# EAGLE schematic FINAL COMMON BOARD (EAGLE 9.5.2)
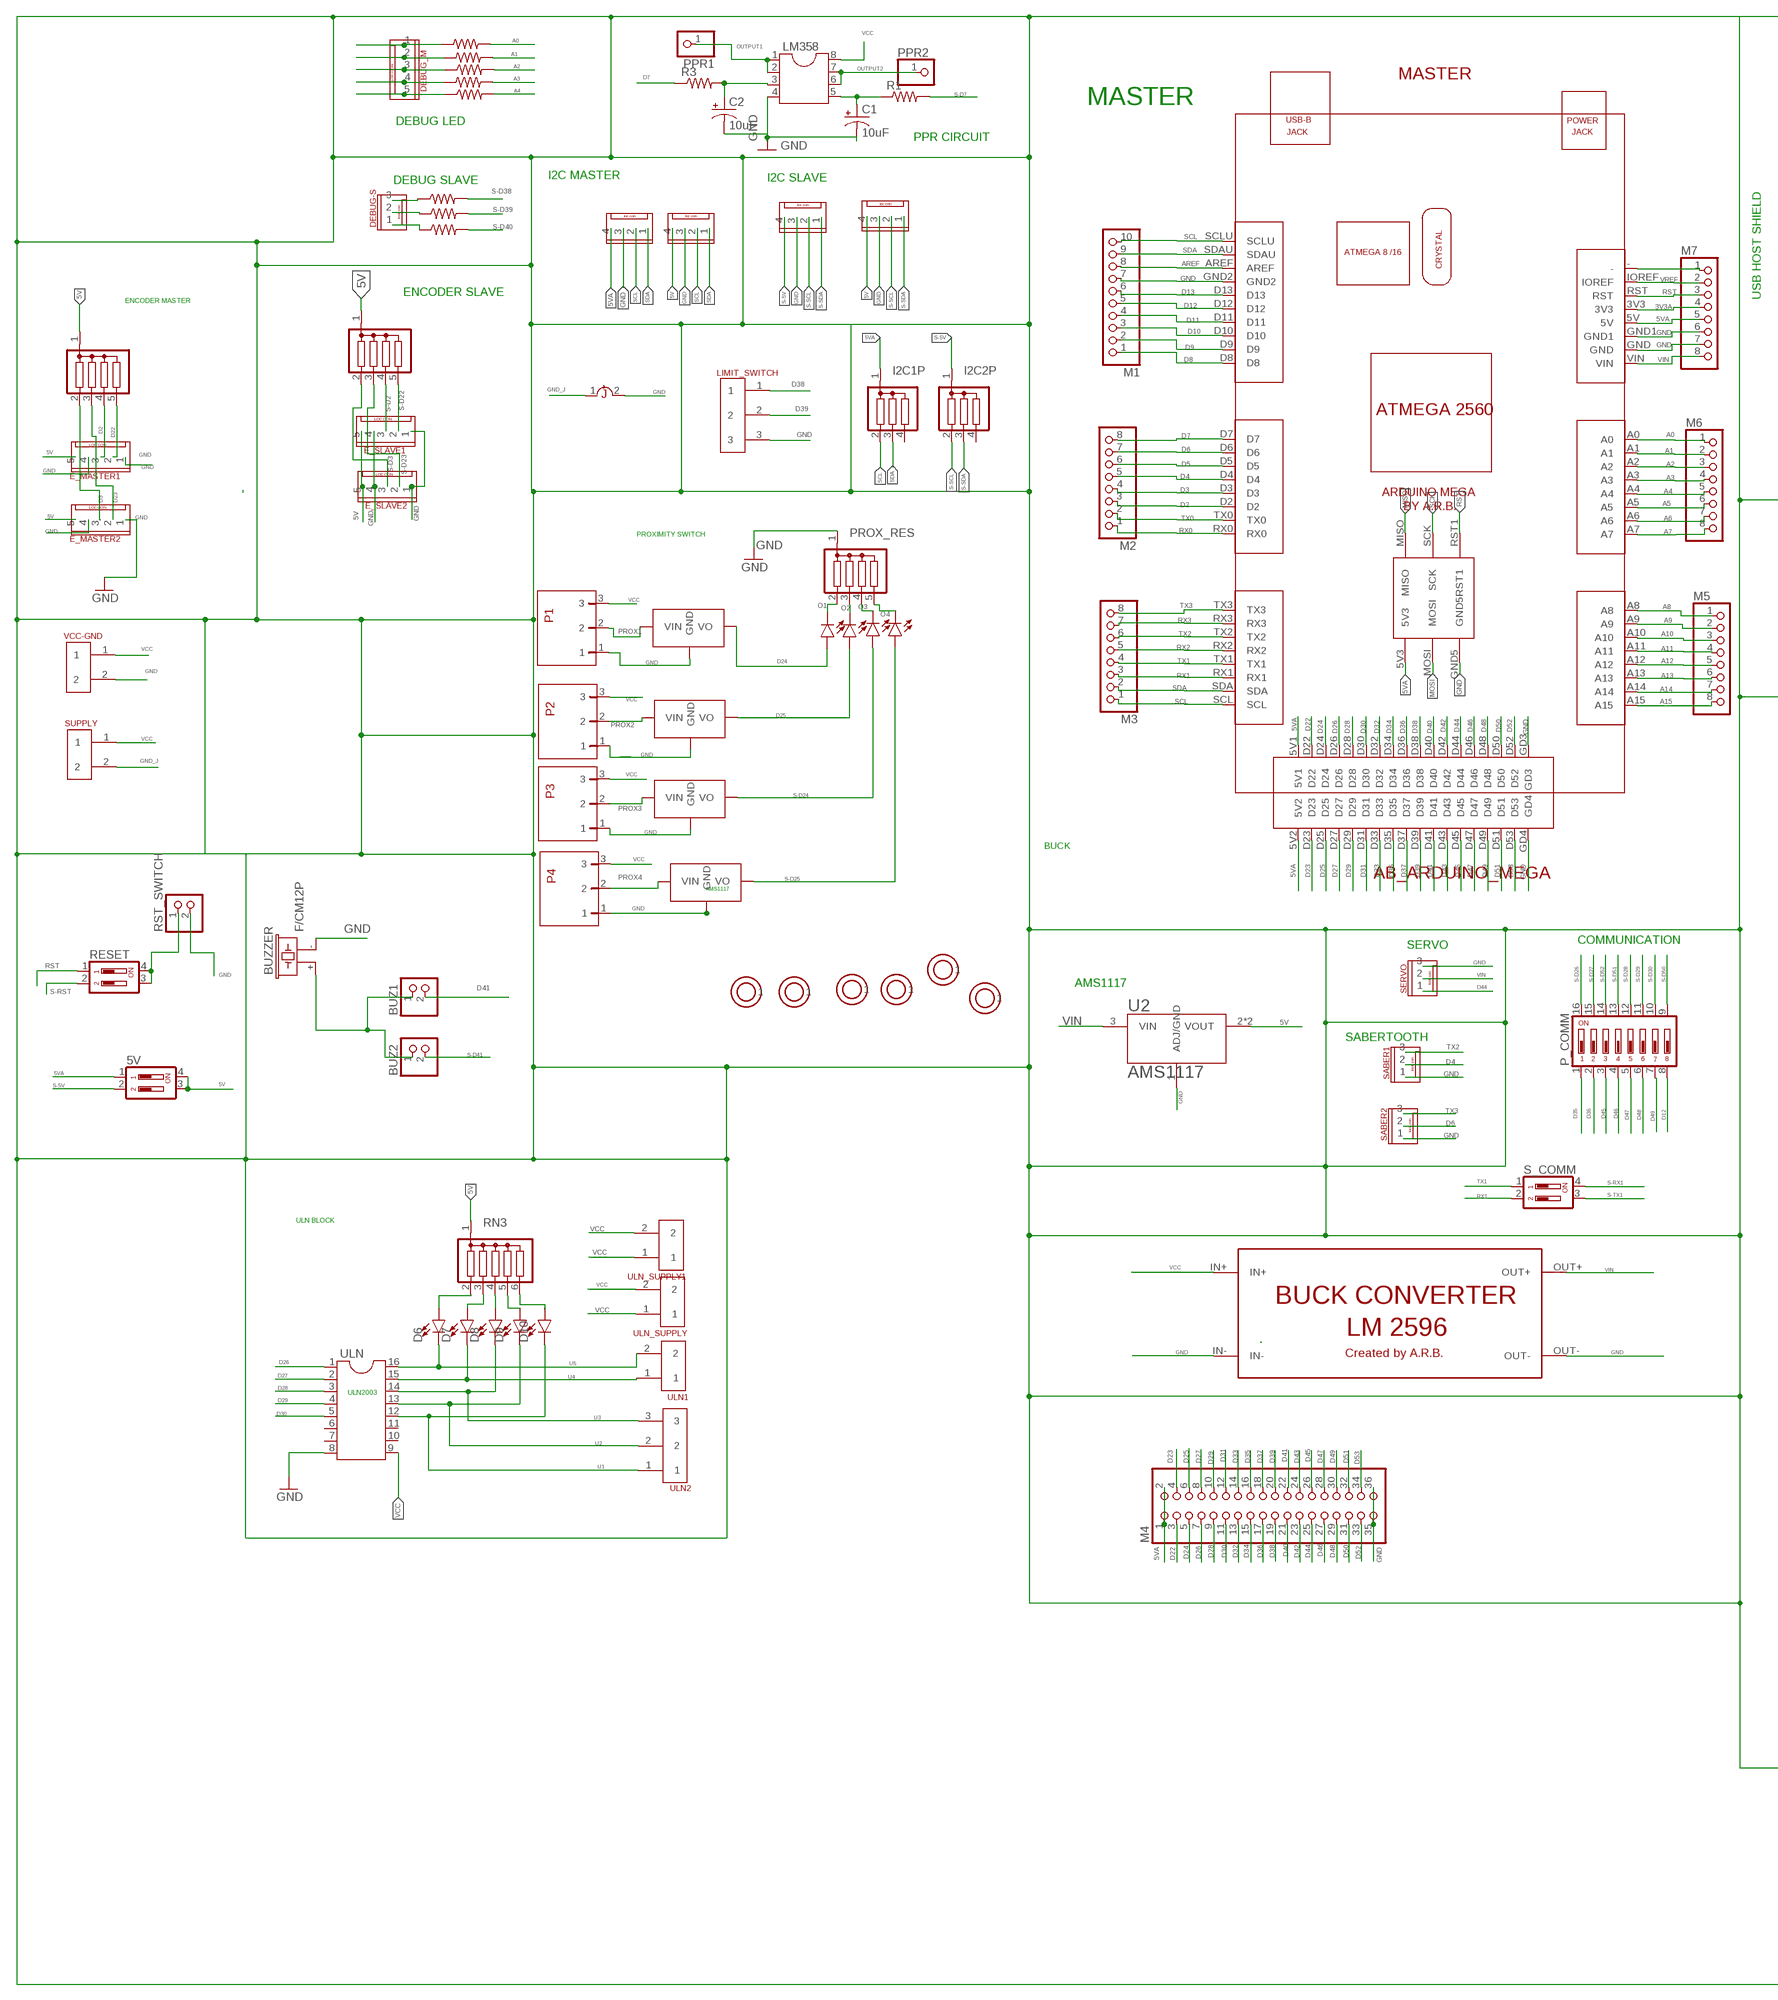
[diagram p0: schematic, sheet 1, part 1 of 2]
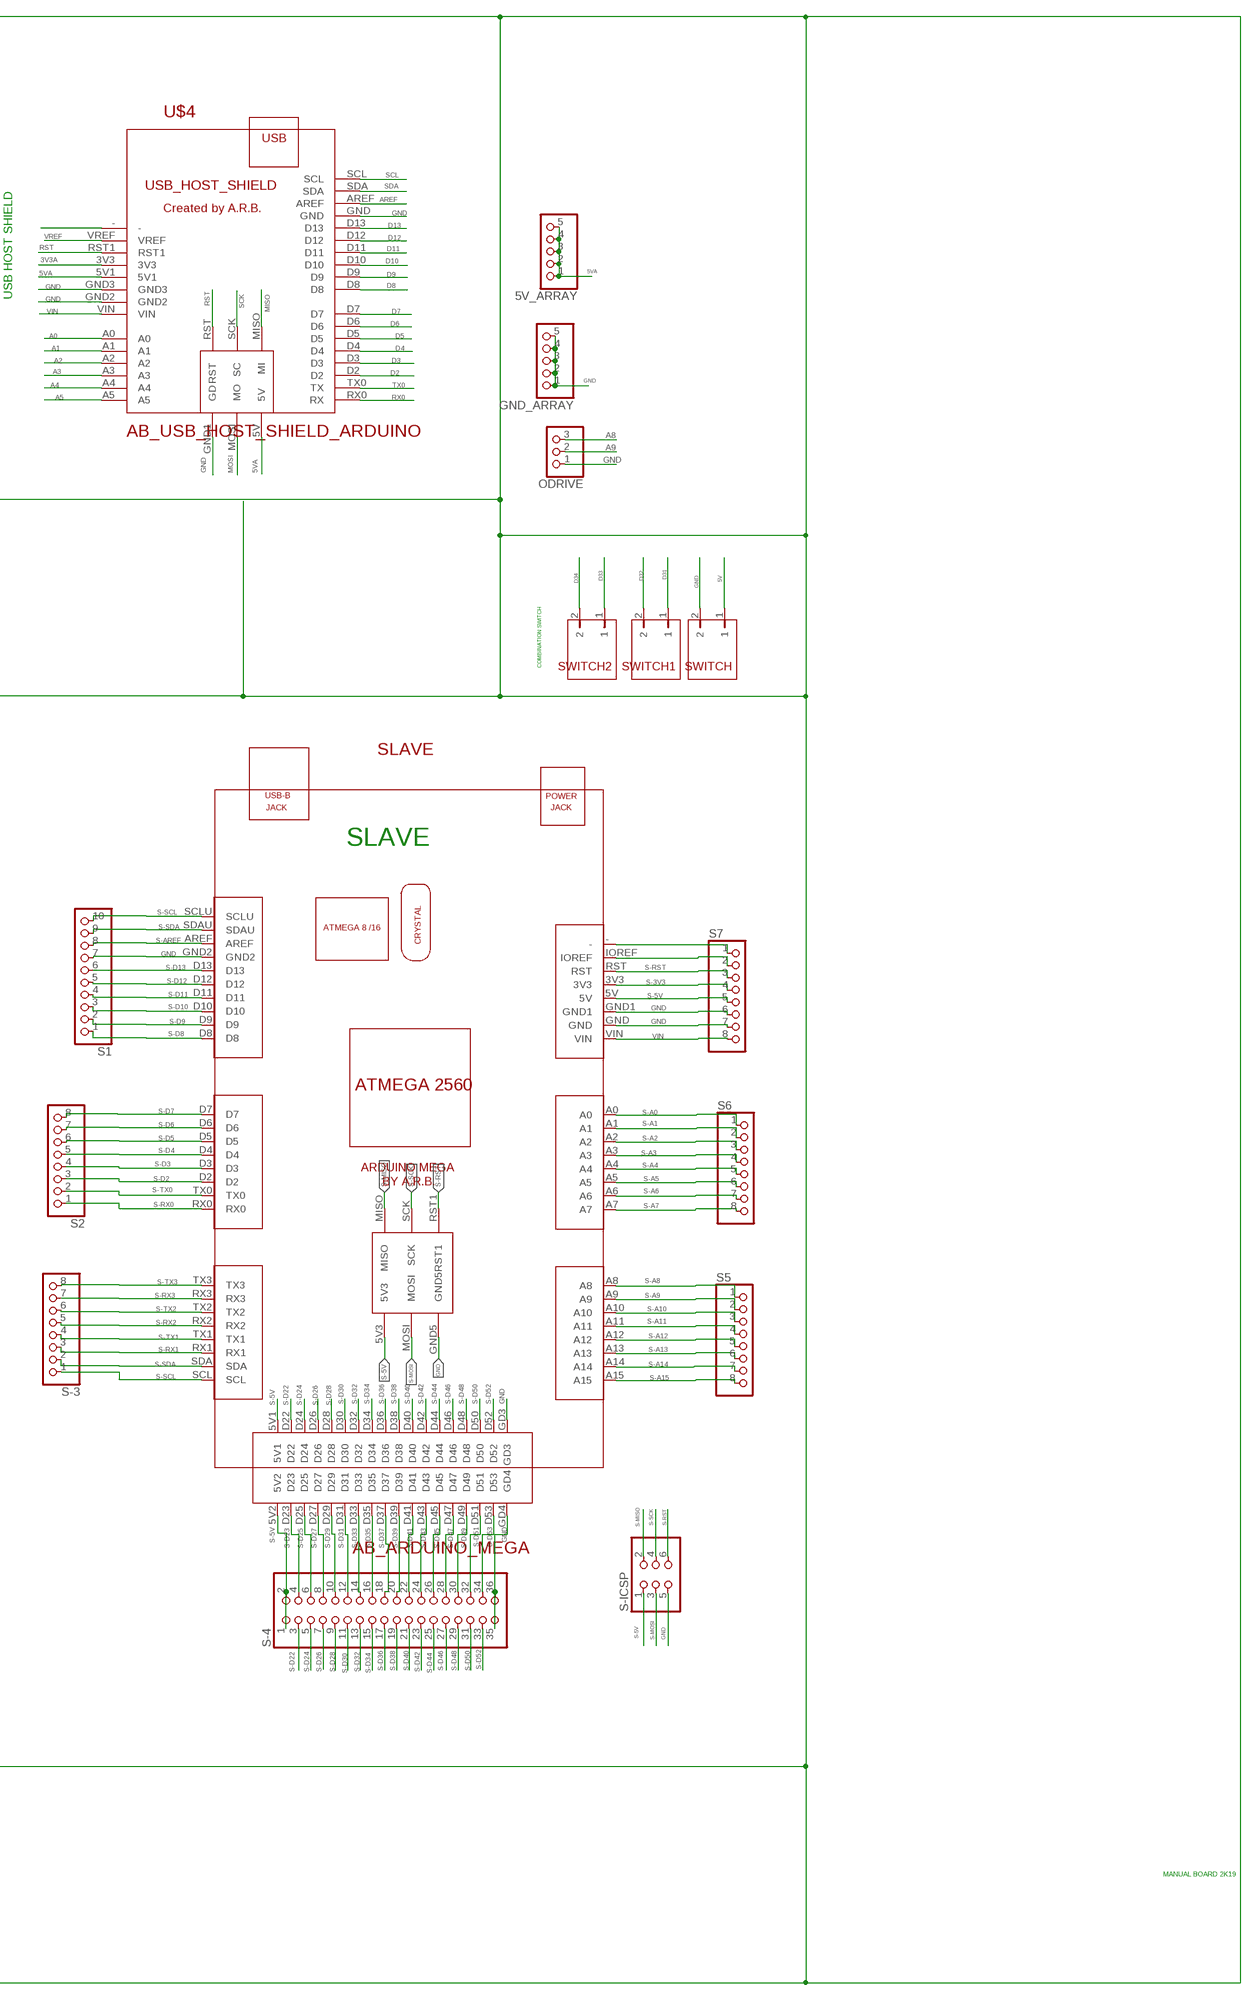
[diagram p1: schematic, sheet 1, part 2 of 2]

## Parts
5V  DIP02YL  [DIP02YL]
5V_ARRAY  PINHD-1X5  [1X05]
BUZ1  PINHD-1X2  [1X02]
BUZ2  PINHD-1X2  [1X02]
BUZZER  F/CM12P  [F/CM12P]
C1  10uF  10UF-POLAR-RADIAL-2.5MM-25V-20%  [CPOL-RADIAL-2.5MM-5MM]
C2  10uF  10UF-POLAR-RADIAL-2.5MM-25V-20%  [CPOL-RADIAL-2.5MM-5MM]
D1  LED-3MM-NO_SILK  [LED_3MM-NS]
D2  LED-3MM-NO_SILK  [LED_3MM-NS]
D3  LED-3MM-NO_SILK  [LED_3MM-NS]
D6  LED-3MM-NO_SILK  [LED_3MM-NS]
D7  LED-3MM-NO_SILK  [LED_3MM-NS]
D8  LED-3MM-NO_SILK  [LED_3MM-NS]
D9  LED-3MM-NO_SILK  [LED_3MM-NS]
D10  LED-3MM-NO_SILK  [LED_3MM-NS]
D14  LED-3MM-NO_SILK  [LED_3MM-NS]
DEBUG-S  AB_3PIN_LOC_CONNECTOR  [AB_3PIN_LOC_CONNECTOR]
DEBUG_M  AB_5PIN_LOC_CONNECTOR  [AB_5PIN_LOC_CONNECTOR]
E_MASTER1  AB_5PIN_LOC_CONNECTOR  [AB_5PIN_LOC_CONNECTOR]
E_MASTER2  AB_5PIN_LOC_CONNECTOR  [AB_5PIN_LOC_CONNECTOR]
E_SLAVE1  AB_5PIN_LOC_CONNECTOR  [AB_5PIN_LOC_CONNECTOR]
E_SLAVE2  AB_5PIN_LOC_CONNECTOR  [AB_5PIN_LOC_CONNECTOR]
GND_ARRAY  PINHD-1X5  [1X05]
I2C1P  G03R  [SIL4]
I2C2P  G03R  [SIL4]
IMU_BLOCK2  AB_4PIN_LOC_CONNECTOR  [AB_4PIN_LOC_CONNECTOR]
IMU_BLOCK3  AB_4PIN_LOC_CONNECTOR  [AB_4PIN_LOC_CONNECTOR]
IMU_BLOCK4  AB_4PIN_LOC_CONNECTOR  [AB_4PIN_LOC_CONNECTOR]
IMU_MASTER  AB_4PIN_LOC_CONNECTOR  [AB_4PIN_LOC_CONNECTOR]
LIMIT_SWITCH  AB_SCREW_TER_5MM_3PIN  [AB_SCREW_TER_5MM_3PIN]
LM358  DIL8  [DIL08]
M1  PINHD-1X10  [1X10]
M2  PINHD-1X8  [1X08]
M3  PINHD-1X8  [1X08]
M4  PINHD-2X18  [2X18]
M5  PINHD-1X8  [1X08]
M6  PINHD-1X8  [1X08]
M7  PINHD-1X8  [1X08]
MASTER  AB_ARDUINO_MEGA  [AB_ARDUINO_MEGA]
ODRIVE  PINHD-1X3  [1X03]
P1  P1  AB_RIGHT_TER_BLK_3PIN  [AB_RIGHT_TER_BLK_3PIN]
P2  P2  AB_RIGHT_TER_BLK_3PIN  [AB_RIGHT_TER_BLK_3PIN]
P3  P3  AB_RIGHT_TER_BLK_3PIN  [AB_RIGHT_TER_BLK_3PIN]
P4  P4  AB_RIGHT_TER_BLK_3PIN  [AB_RIGHT_TER_BLK_3PIN]
P_COMM  DIP08YL  [DIP08YL]
PPR1  PINHD-1X1  [1X01]
PPR2  PINHD-1X1  [1X01]
PROX_RES  G04R  [SIL5]
PULL_MASTER  G04R  [SIL5]
PULL_SLAVE  G04R  [SIL5]
R1  R-US_0204/7  [0204/7]
R2  R-US_0204/7  [0204/7]
R3  R-US_0204/7  [0204/7]
R4  R-US_0204/7  [0204/7]
R5  R-US_0204/7  [0204/7]
R6  R-US_0204/7  [0204/7]
R7  R-US_0204/7  [0204/7]
R8  R-US_0204/7  [0204/7]
R9  R-US_0204/7  [0204/7]
R10  R-US_0204/7  [0204/7]
RESET  DIP02YL  [DIP02YL]
RN3  G05R  [SIL6]
RST_SWITCH  PINHD-1X2  [1X02]
S1  PINHD-1X10  [1X10]
S2  PINHD-1X8  [1X08]
S5  PINHD-1X8  [1X08]
S6  PINHD-1X8  [1X08]
S7  PINHD-1X8  [1X08]
S-3  PINHD-1X8  [1X08]
S-4  PINHD-2X18  [2X18]
S-ICSP  PINHD-2X3  [2X03]
S_COMM  DIP02YL  [DIP02YL]
SABER1  AB_3PIN_LOC_CONNECTOR  [AB_3PIN_LOC_CONNECTOR]
SABER2  AB_3PIN_LOC_CONNECTOR  [AB_3PIN_LOC_CONNECTOR]
SERVO  AB_3PIN_LOC_CONNECTOR  [AB_3PIN_LOC_CONNECTOR]
SLAVE  AB_ARDUINO_MEGA  [AB_ARDUINO_MEGA]
SUPPLY  AB_SCREW_TERMINAL_5MM_2PIN  [AB_SCREW_TERMINAL_5MM_2PIN]
SWITCH  AB_RIGHT_TER_BLK  [AB_RIGHT_TER_BLK]
SWITCH1  AB_RIGHT_TER_BLK  [AB_RIGHT_TER_BLK]
SWITCH2  AB_RIGHT_TER_BLK  [AB_RIGHT_TER_BLK]
U2  AMS1117  [SOT229P700X180-4N]
U$1  PLATED_DRILL_3.5MM  [PLATED_DRILL_3.5MM]
U$2  PLATED_DRILL_3.5MM  [PLATED_DRILL_3.5MM]
U$3  AB_LM2596_BUCK_CONVERTER  [AB_LM2596_BUCK_CONVERTER]
U$4  AB_USB_HOST_SHIELD_ARDUINO  [AB_USB_HOST_SHIELD_ARDUINO]
U$5  PLATED_DRILL_3.5MM  [PLATED_DRILL_3.5MM]
U$6  PLATED_DRILL_3.5MM  [PLATED_DRILL_3.5MM]
U$7  PLATED_DRILL_3.5MM  [PLATED_DRILL_3.5MM]
U$8  PLATED_DRILL_3.5MM  [PLATED_DRILL_3.5MM]
U$23  AB_7805_FLAT  [AB_7805_FLAT]
U$24  AB_7805_FLAT  [AB_7805_FLAT]
U$25  AB_7805_FLAT  [AB_7805_FLAT]
U$26  AB_7805_FLAT  [AB_7805_FLAT]
U$35  AB_JUMPER_ONE_WAY  [AB_JUMPER_ONE_WAY]
ULN  DIL16  [DIL16]
ULN1  AB_SCREW_TERMINAL_5MM_2PIN  [AB_SCREW_TERMINAL_5MM_2PIN]
ULN2  AB_SCREW_TER_5MM_3PIN  [AB_SCREW_TER_5MM_3PIN]
ULN_SUPPLY  AB_SCREW_TERMINAL_5MM_2PIN  [AB_SCREW_TERMINAL_5MM_2PIN]
ULN_SUPPLY1  AB_SCREW_TERMINAL_5MM_2PIN  [AB_SCREW_TERMINAL_5MM_2PIN]
VCC-GND  AB_SCREW_TERMINAL_5MM_2PIN  [AB_SCREW_TERMINAL_5MM_2PIN]

## Nets
3V3A [arduino master]: M7.4 MASTER.3V3 U$4.3V3
5V: 5V.3 5V.4 E_MASTER1.5 E_MASTER2.5 E_SLAVE1.5 E_SLAVE2.5 IMU_BLOCK2.4 IMU_BLOCK4.4 PULL_MASTER.1 PULL_SLAVE.1 RN3.1 SWITCH.1 U2.2(VOUT) U2.4(VOUT)
5VA [vin]: 5V.1 5V_ARRAY.1 5V_ARRAY.2 5V_ARRAY.3 5V_ARRAY.4 5V_ARRAY.5 I2C1P.1 IMU_MASTER.4 M4.1 M4.2 M7.5 MASTER.5V MASTER.5V1 MASTER.5V2 MASTER.5V3 U$4.5V U$4.5V1
A0 [arduino master]: M6.1 MASTER.A0 R2.2 U$4.A0
A1 [arduino master]: M6.2 MASTER.A1 R4.2 U$4.A1
A2 [arduino master]: M6.3 MASTER.A2 R5.2 U$4.A2
A3 [arduino master]: M6.4 MASTER.A3 R6.2 U$4.A3
A4 [arduino master]: M6.5 MASTER.A4 R7.2 U$4.A4
A5 [arduino master]: M6.6 MASTER.A5 U$4.A5
A6 [arduino master]: M6.7 MASTER.A6
A7 [arduino master]: M6.8 MASTER.A7
A8 [arduino master]: M5.1 MASTER.A8 ODRIVE.3
A9 [arduino master]: M5.2 MASTER.A9 ODRIVE.2
A10 [arduino master]: M5.3 MASTER.A10
A11 [arduino master]: M5.4 MASTER.A11
A12 [arduino master]: M5.5 MASTER.A12
A13 [arduino master]: M5.6 MASTER.A13
A14 [arduino master]: M5.7 MASTER.A14
A15 [arduino master]: M5.8 MASTER.A15
AREF [arduino master]: M1.8 MASTER.AREF U$4.AREF
D2 [arduino master]: E_MASTER1.3 M2.3 MASTER.D2 PULL_MASTER.4 U$4.D2
D3 [arduino master]: E_MASTER2.3 M2.4 MASTER.D3 PULL_MASTER.2 U$4.D3
D4 [arduino master]: M2.5 MASTER.D4 SABER1.2 U$4.D4
D5 [arduino master]: M2.6 MASTER.D5 U$4.D5
D6 [arduino master]: M2.7 MASTER.D6 SABER2.2 U$4.D6
D7 [arduino master]: M2.8 MASTER.D7 R3.1 U$4.D7
D8 [arduino master]: M1.1 MASTER.D8 U$4.D8
D9 [arduino master]: M1.2 MASTER.D9 U$4.D9
D10 [arduino master]: M1.3 MASTER.D10 U$4.D10
D11 [arduino master]: M1.4 MASTER.D11 U$4.D11
D12 [arduino master]: M1.5 MASTER.D12 P_COMM.8 U$4.D12
D13 [arduino master]: M1.6 MASTER.D13 U$4.D13
D22 [arduino master]: E_MASTER1.2 M4.3 MASTER.D22 PULL_MASTER.5
D23 [arduino master]: E_MASTER2.2 M4.4 MASTER.D23 PULL_MASTER.3
D24 [arduino master]: D14.A M4.5 MASTER.D24 U$23.3(VO)
D25 [arduino master]: D1.A M4.6 MASTER.D25 U$24.3(VO)
D26 [arduino master]: M4.7 MASTER.D26 ULN.1
D27 [arduino master]: M4.8 MASTER.D27 ULN.2
D28 [arduino master]: M4.9 MASTER.D28 ULN.3
D29 [arduino master]: M4.10 MASTER.D29 ULN.4
D30 [arduino master]: M4.11 MASTER.D30 ULN.5
D31 [arduino master]: M4.12 MASTER.D31 SWITCH1.1
D32 [arduino master]: M4.13 MASTER.D32 SWITCH1.2
D33 [arduino master]: M4.14 MASTER.D33 SWITCH2.1
D34 [arduino master]: M4.15 MASTER.D34 SWITCH2.2
D35 [arduino master]: M4.16 MASTER.D35 P_COMM.1
D36 [arduino master]: M4.17 MASTER.D36 P_COMM.2
D37 [arduino master]: M4.18 MASTER.D37
D38 [arduino master]: LIMIT_SWITCH.1 M4.19 MASTER.D38
D39 [arduino master]: LIMIT_SWITCH.2 M4.20 MASTER.D39
D40 [arduino master]: M4.21 MASTER.D40
D41 [arduino master]: BUZ1.2 M4.22 MASTER.D41
D42 [arduino master]: M4.23 MASTER.D42
D43 [arduino master]: M4.24 MASTER.D43
D44 [arduino master]: M4.25 MASTER.D44 SERVO.1
D45 [arduino master]: M4.26 MASTER.D45 P_COMM.3
D46 [arduino master]: M4.27 MASTER.D46 P_COMM.4
D47 [arduino master]: M4.28 MASTER.D47 P_COMM.5
D48 [arduino master]: M4.29 MASTER.D48 P_COMM.6
D49 [arduino master]: M4.30 MASTER.D49 P_COMM.7
D50 [arduino master]: M4.31 MASTER.D50
D51 [arduino master]: M4.32 MASTER.D51
D52 [arduino master]: M4.33 MASTER.D52
D53 [arduino master]: M4.34 MASTER.D53
GND: BUZZER.- C1.2(-) C2.2(-) E_MASTER1.1 E_MASTER1.4 E_MASTER2.1 E_MASTER2.4 E_SLAVE1.1 E_SLAVE1.4 E_SLAVE2.1 E_SLAVE2.4 GND_ARRAY.1 GND_ARRAY.2 GND_ARRAY.3 GND_ARRAY.4 GND_ARRAY.5 IMU_BLOCK2.3 IMU_BLOCK3.3 IMU_BLOCK4.3 IMU_MASTER.3 LIMIT_SWITCH.3 LM358.4 M1.7 M4.35 M4.36 M7.6 M7.7 MASTER.GD3 MASTER.GD4 MASTER.GND MASTER.GND1 MASTER.GND2 MASTER.GND5 ODRIVE.1 P1.1 P2.1 P3.1 P4.1 PROX_RES.1 RST_SWITCH.2 S1.7 S7.6 S7.7 S-4.35 S-4.36 S-ICSP.5 SABER1.1 SABER2.1 SERVO.3 SLAVE.GD3 SLAVE.GD4 SLAVE.GND SLAVE.GND1 SLAVE.GND2 SLAVE.GND5 SWITCH.2 U2.1(ADJ/GND) U$3.IN- U$3.OUT- U$4.GND U$4.GND1(GD) U$4.GND2 U$4.GND3 U$23.2(GND) U$24.2(GND) U$25.2(GND) U$26.2(GND) U$35.2 ULN.8 VCC-GND.2
GND_J: SUPPLY.2 U$35.1
MISO [arduino master]: MASTER.MISO U$4.MISO(MI)
MOSI [arduino master]: MASTER.MOSI U$4.MOSI(MO)
N$2: C1.1(+) LM358.5 R1.1
N$3: M7.1 MASTER.-
N$4: S7.1 SLAVE.-
N$5: BUZ1.1 BUZ2.1 BUZZER.+
N$6: C2.1(+) LM358.3 R3.2
N$7: RESET.3 RESET.4 RST_SWITCH.1
N$11: DEBUG_M.1 R2.1
N$12: D6.A RN3.2
N$13: D7.A RN3.3
N$14: D8.A RN3.4
N$15: D9.A RN3.5
N$16: D10.A RN3.6
N$22: DEBUG_M.2 R4.1
N$23: DEBUG_M.3 R5.1
N$24: DEBUG_M.4 R6.1
N$25: DEBUG_M.5 R7.1
N$42: DEBUG-S.3 R8.1
N$43: DEBUG-S.2 R9.1
N$44: DEBUG-S.1 R10.1
N$62: U$4.-
N$63: S7.2 SLAVE.IOREF
O1: D14.K(C) PROX_RES.2
O2: D1.K(C) PROX_RES.3
O3: D2.K(C) PROX_RES.4
O4: D3.K(C) PROX_RES.5
OUTPUT1: LM358.1 LM358.2 PPR1.1
OUTPUT2: LM358.6 LM358.7 PPR2.1
PROX1 [proximity]: P1.2 U$23.1(VIN)
PROX2 [proximity]: P2.2 U$24.1(VIN)
PROX3 [proximity]: P3.2 U$25.1(VIN)
PROX4 [proximity]: P4.2 U$26.1(VIN)
RST [arduino master]: M7.3 MASTER.RST MASTER.RST1 RESET.1 U$4.RST U$4.RST1
RX0 [arduino master]: M2.1 MASTER.RX0 U$4.RX0(RX)
RX1 [arduino master]: M3.3 MASTER.RX1 S_COMM.2
RX2 [arduino master]: M3.5 MASTER.RX2
RX3 [arduino master]: M3.7 MASTER.RX3
S-3V3 [arduino slave]: S7.4 SLAVE.3V3
S-5V [vin]: 5V.2 I2C2P.1 IMU_BLOCK3.4 S7.5 S-4.1 S-4.2 S-ICSP.1 SLAVE.5V SLAVE.5V1 SLAVE.5V2 SLAVE.5V3
S-A0 [arduino slave]: S6.1 SLAVE.A0
S-A1 [arduino slave]: S6.2 SLAVE.A1
S-A2 [arduino slave]: S6.3 SLAVE.A2
S-A3 [arduino slave]: S6.4 SLAVE.A3
S-A4 [arduino slave]: S6.5 SLAVE.A4
S-A5 [arduino slave]: S6.6 SLAVE.A5
S-A6 [arduino slave]: S6.7 SLAVE.A6
S-A7 [arduino slave]: S6.8 SLAVE.A7
S-A8 [arduino slave]: S5.1 SLAVE.A8
S-A9 [arduino slave]: S5.2 SLAVE.A9
S-A10 [arduino slave]: S5.3 SLAVE.A10
S-A11 [arduino slave]: S5.4 SLAVE.A11
S-A12 [arduino slave]: S5.5 SLAVE.A12
S-A13 [arduino slave]: S5.6 SLAVE.A13
S-A14 [arduino slave]: S5.7 SLAVE.A14
S-A15 [arduino slave]: S5.8 SLAVE.A15
S-AREF [arduino slave]: S1.8 SLAVE.AREF
S-D2 [arduino slave]: E_SLAVE1.3 PULL_SLAVE.4 S2.3 SLAVE.D2
S-D3 [arduino slave]: E_SLAVE2.3 PULL_SLAVE.2 S2.4 SLAVE.D3
S-D4 [arduino slave]: S2.5 SLAVE.D4
S-D5 [arduino slave]: S2.6 SLAVE.D5
S-D6 [arduino slave]: S2.7 SLAVE.D6
S-D7 [arduino slave]: R1.2 S2.8 SLAVE.D7
S-D8 [arduino slave]: S1.1 SLAVE.D8
S-D9 [arduino slave]: S1.2 SLAVE.D9
S-D10 [arduino slave]: S1.3 SLAVE.D10
S-D11 [arduino slave]: S1.4 SLAVE.D11
S-D12 [arduino slave]: S1.5 SLAVE.D12
S-D13 [arduino slave]: S1.6 SLAVE.D13
S-D22 [arduino slave]: E_SLAVE1.2 PULL_SLAVE.5 S-4.3 SLAVE.D22
S-D23 [arduino slave]: E_SLAVE2.2 PULL_SLAVE.3 S-4.4 SLAVE.D23
S-D24 [arduino slave]: D2.A S-4.5 SLAVE.D24 U$25.3(VO)
S-D25 [arduino slave]: D3.A S-4.6 SLAVE.D25 U$26.3(VO)
S-D26 [arduino slave]: P_COMM.16 S-4.7 SLAVE.D26
S-D27 [arduino slave]: P_COMM.15 S-4.8 SLAVE.D27
S-D28 [arduino slave]: P_COMM.12 S-4.9 SLAVE.D28
S-D29 [arduino slave]: P_COMM.11 S-4.10 SLAVE.D29
S-D30 [arduino slave]: P_COMM.10 S-4.11 SLAVE.D30
S-D31 [arduino slave]: S-4.12 SLAVE.D31
S-D32 [arduino slave]: S-4.13 SLAVE.D32
S-D33 [arduino slave]: S-4.14 SLAVE.D33
S-D34 [arduino slave]: S-4.15 SLAVE.D34
S-D35 [arduino slave]: S-4.16 SLAVE.D35
S-D36 [arduino slave]: S-4.17 SLAVE.D36
S-D37 [arduino slave]: S-4.18 SLAVE.D37
S-D38 [arduino slave]: R8.2 S-4.19 SLAVE.D38
S-D39 [arduino slave]: R9.2 S-4.20 SLAVE.D39
S-D40 [arduino slave]: R10.2 S-4.21 SLAVE.D40
S-D41 [arduino slave]: BUZ2.2 S-4.22 SLAVE.D41
S-D42 [arduino slave]: S-4.23 SLAVE.D42
S-D43 [arduino slave]: S-4.24 SLAVE.D43
S-D44 [arduino slave]: S-4.25 SLAVE.D44
S-D45 [arduino slave]: S-4.26 SLAVE.D45
S-D46 [arduino slave]: S-4.27 SLAVE.D46
S-D47 [arduino slave]: S-4.28 SLAVE.D47
S-D48 [arduino slave]: S-4.29 SLAVE.D48
S-D49 [arduino slave]: S-4.30 SLAVE.D49
S-D50 [arduino slave]: P_COMM.9 S-4.31 SLAVE.D50
S-D51 [arduino slave]: P_COMM.13 S-4.32 SLAVE.D51
S-D52 [arduino slave]: P_COMM.14 S-4.33 SLAVE.D52
S-D53 [arduino slave]: S-4.34 SLAVE.D53
S-MISO [arduino slave]: S-ICSP.2 SLAVE.MISO
S-MOSI [arduino slave]: S-ICSP.3 SLAVE.MOSI
S-RST [arduino slave]: RESET.2 S7.3 S-ICSP.6 SLAVE.RST SLAVE.RST1
S-RX0 [arduino slave]: S2.1 SLAVE.RX0
S-RX1 [arduino slave]: S-3.3 S_COMM.4 SLAVE.RX1
S-RX2 [arduino slave]: S-3.5 SLAVE.RX2
S-RX3 [arduino slave]: S-3.7 SLAVE.RX3
S-SCK [arduino slave]: S-ICSP.4 SLAVE.SCK
S-SCL [arduino slave]: I2C2P.2 IMU_BLOCK3.2 IMU_BLOCK4.2 S1.10 S-3.1 SLAVE.SCL SLAVE.SCLU
S-SDA [arduino slave]: I2C2P.3 IMU_BLOCK3.1 IMU_BLOCK4.1 S1.9 S-3.2 SLAVE.SDA SLAVE.SDAU
S-TX0 [arduino slave]: S2.2 SLAVE.TX0
S-TX1 [arduino slave]: S-3.4 S_COMM.3 SLAVE.TX1
S-TX2 [arduino slave]: S-3.6 SLAVE.TX2
S-TX3 [arduino slave]: S-3.8 SLAVE.TX3
SCK [arduino master]: MASTER.SCK U$4.SCK(SC)
SCL [arduino master]: I2C1P.2 IMU_BLOCK2.2 IMU_MASTER.2 M1.10 M3.1 MASTER.SCL MASTER.SCLU U$4.SCL
SDA [arduino master]: I2C1P.3 IMU_BLOCK2.1 IMU_MASTER.1 M1.9 M3.2 MASTER.SDA MASTER.SDAU U$4.SDA
TX0 [arduino master]: M2.2 MASTER.TX0 U$4.TX0(TX)
TX1 [arduino master]: M3.4 MASTER.TX1 S_COMM.1
TX2 [arduino master]: M3.6 MASTER.TX2 SABER1.3
TX3 [arduino master]: M3.8 MASTER.TX3 SABER2.3
U1: D10.K(C) ULN2.1 ULN.12
U2: D9.K(C) ULN2.2 ULN.13
U3: D8.K(C) ULN2.3 ULN.14
U4: D7.K(C) ULN1.1 ULN.15
U5: D6.K(C) ULN1.2 ULN.16
VCC: LM358.8 P1.3 P2.3 P3.3 P4.3 SUPPLY.1 U$3.IN+ ULN.9 ULN_SUPPLY1.1 ULN_SUPPLY1.2 ULN_SUPPLY.1 ULN_SUPPLY.2 VCC-GND.1
VIN [vin]: M7.8 MASTER.VIN S7.8 SERVO.2 SLAVE.VIN U2.3(VIN) U$3.OUT+ U$4.VIN
VREF [arduino master]: M7.2 MASTER.IOREF U$4.VREF
Unconnected: I2C1P.4 I2C2P.4 U$1.1 U$2.1 U$5.1 U$6.1 U$7.1 U$8.1 ULN.6 ULN.7 ULN.10 ULN.11

## Notes on the sheet
- MASTER
- DEBUG LED
- PPR CIRCUIT
- I2C MASTER | I2C SLAVE
- DEBUG SLAVE
- ENCODER SLAVE
- USB HOST SHIELD
- ENCODER MASTER
- PROXIMITY SWITCH
- COMBINATION SWITCH
- BUCK | SLAVE
- AMS1117
- COMMUNICATION
- SERVO
- AMS1117
- SABERTOOTH
- ULN BLOCK
- ULN2003
- MANUAL BOARD 2K19

## Library data of the parts
5V RESET S_COMM = switch-dil:DIP02YL: DIL/CODE SWITCH; OC_FARNELL: unknown; OC_NEWARK: unknown
5V_ARRAY GND_ARRAY = pinhead:PINHD-1X5: PIN HEADER
BUZ1 BUZ2 RST_SWITCH = pinhead:PINHD-1X2: PIN HEADER
BUZZER = buzzer:F/CM12P: BUZZER Source: Buerklin; OC_FARNELL: unknown; OC_NEWARK: unknown
C1 C2 = SparkFun-Capacitors:10UF-POLAR: 10.0µF polarized capacitors A capacitor is a passive two-terminal electrical component used to store electrical energy temporarily in an electric field.; PROD_ID: CAP-08440
D1-D3 D6-D10 D14 = SparkFun-LED:LED: LED (Generic) Standard schematic elements and footprints for 5mm, 3mm, 1206, and 0603 sized LEDs. Generic LEDs with no color specified.
DEBUG-S SABER1 SABER2 SERVO = AB_LOCKING CONNECTORS:AB_3PIN_LOC_CONNECTOR
DEBUG_M E_MASTER1 E_MASTER2 E_SLAVE1 E_SLAVE2 = AB_LOCKING CONNECTORS:AB_5PIN_LOC_CONNECTOR
I2C1P I2C2P = resistor-sil:G03R: SIL RESISTOR; OC_FARNELL: unknown; OC_NEWARK: unknown
IMU_BLOCK2-IMU_BLOCK4 IMU_MASTER = AB_LOCKING CONNECTORS:AB_4PIN_LOC_CONNECTOR
LIMIT_SWITCH ULN2 = AB_SCREW_TER_5MM_3PIN_BIG:AB_SCREW_TER_5MM_3PIN
LM358 = ic-package:DIL8: Dual In Line / Socket
M1 S1 = pinhead:PINHD-1X10: PIN HEADER
M2 M3 M5-M7 S2 S5-S7 S-3 = pinhead:PINHD-1X8: PIN HEADER
M4 S-4 = pinhead:PINHD-2X18: PIN HEADER
MASTER SLAVE = arduino mega 2-06-2019   8.54 (1):AB_ARDUINO_MEGA
ODRIVE = pinhead:PINHD-1X3: PIN HEADER
P1-P4 = AB_Right_angle_terminal_block:AB_RIGHT_TER_BLK_3PIN
P_COMM = switch-dil:DIP08YL: DIL/CODE SWITCH; OC_FARNELL: unknown; OC_NEWARK: unknown
PPR1 PPR2 = pinhead:PINHD-1X1: PIN HEADER
PROX_RES PULL_MASTER PULL_SLAVE = resistor-sil:G04R: SIL RESISTOR; OC_FARNELL: unknown; OC_NEWARK: unknown
R1-R10 = adafruit:R-US_: RESISTOR, American symbol
RN3 = resistor-sil:G05R: SIL RESISTOR; OC_FARNELL: unknown; OC_NEWARK: unknown
S-ICSP = pinhead:PINHD-2X3: PIN HEADER
SUPPLY ULN1 ULN_SUPPLY ULN_SUPPLY1 VCC-GND = AB_SCREW_TER_5MM_2PIN_BIG:AB_SCREW_TERMINAL_5MM_2PIN
SWITCH SWITCH1 SWITCH2 = AB_Right_angle_terminal_block:AB_RIGHT_TER_BLK
U2 = AMS1117:AMS1117: Sot223/Pkg 1-Amp 5-Volt Low Drop Out Voltage Regulatator; AVAILABILITY: Unavailable; DESCRIPTION: UNO PLUS Arduino R3 Shield, Xbee Arduino IDE Wheeled Robotics Kit; MF: Seeed Technology; MP: AMS1117; PACKAGE: SOT-223 Seeed Technology; PRICE: None
U$1 U$2 U$5-U$8 = AB_plated_drill_3.5mm:PLATED_DRILL_3.5MM
U$3 = AB_Voltage_converters_updated 29-07-2019:AB_LM2596_BUCK_CONVERTER
U$4 = AB_ARDUINO_USB_HOST_SHIELD_updated 29-07-2019:AB_USB_HOST_SHIELD_ARDUINO
U$23-U$26 = AB_7805_FLAT:AB_7805_FLAT
U$35 = AB_SMD_JUMPER:AB_JUMPER_ONE_WAY
ULN = ic-package:DIL16: Dual In Line / Socket

## Net classes
0 default: width 0.127 mm, drill 0.279 mm, clearance 0.203 mm
1 arduino master: width 0.305 mm, drill 0.356 mm, clearance 0.254 mm
2 arduino slave: width 0.305 mm, drill 0.356 mm, clearance 0.254 mm
3 proximity: width 0.406 mm, drill 0.381 mm, clearance 0.305 mm
4 vin: width 1.016 mm, drill 0.356 mm, clearance 0.305 mm